# EAGLE design wctrl_led (EAGLE 7.6.0)
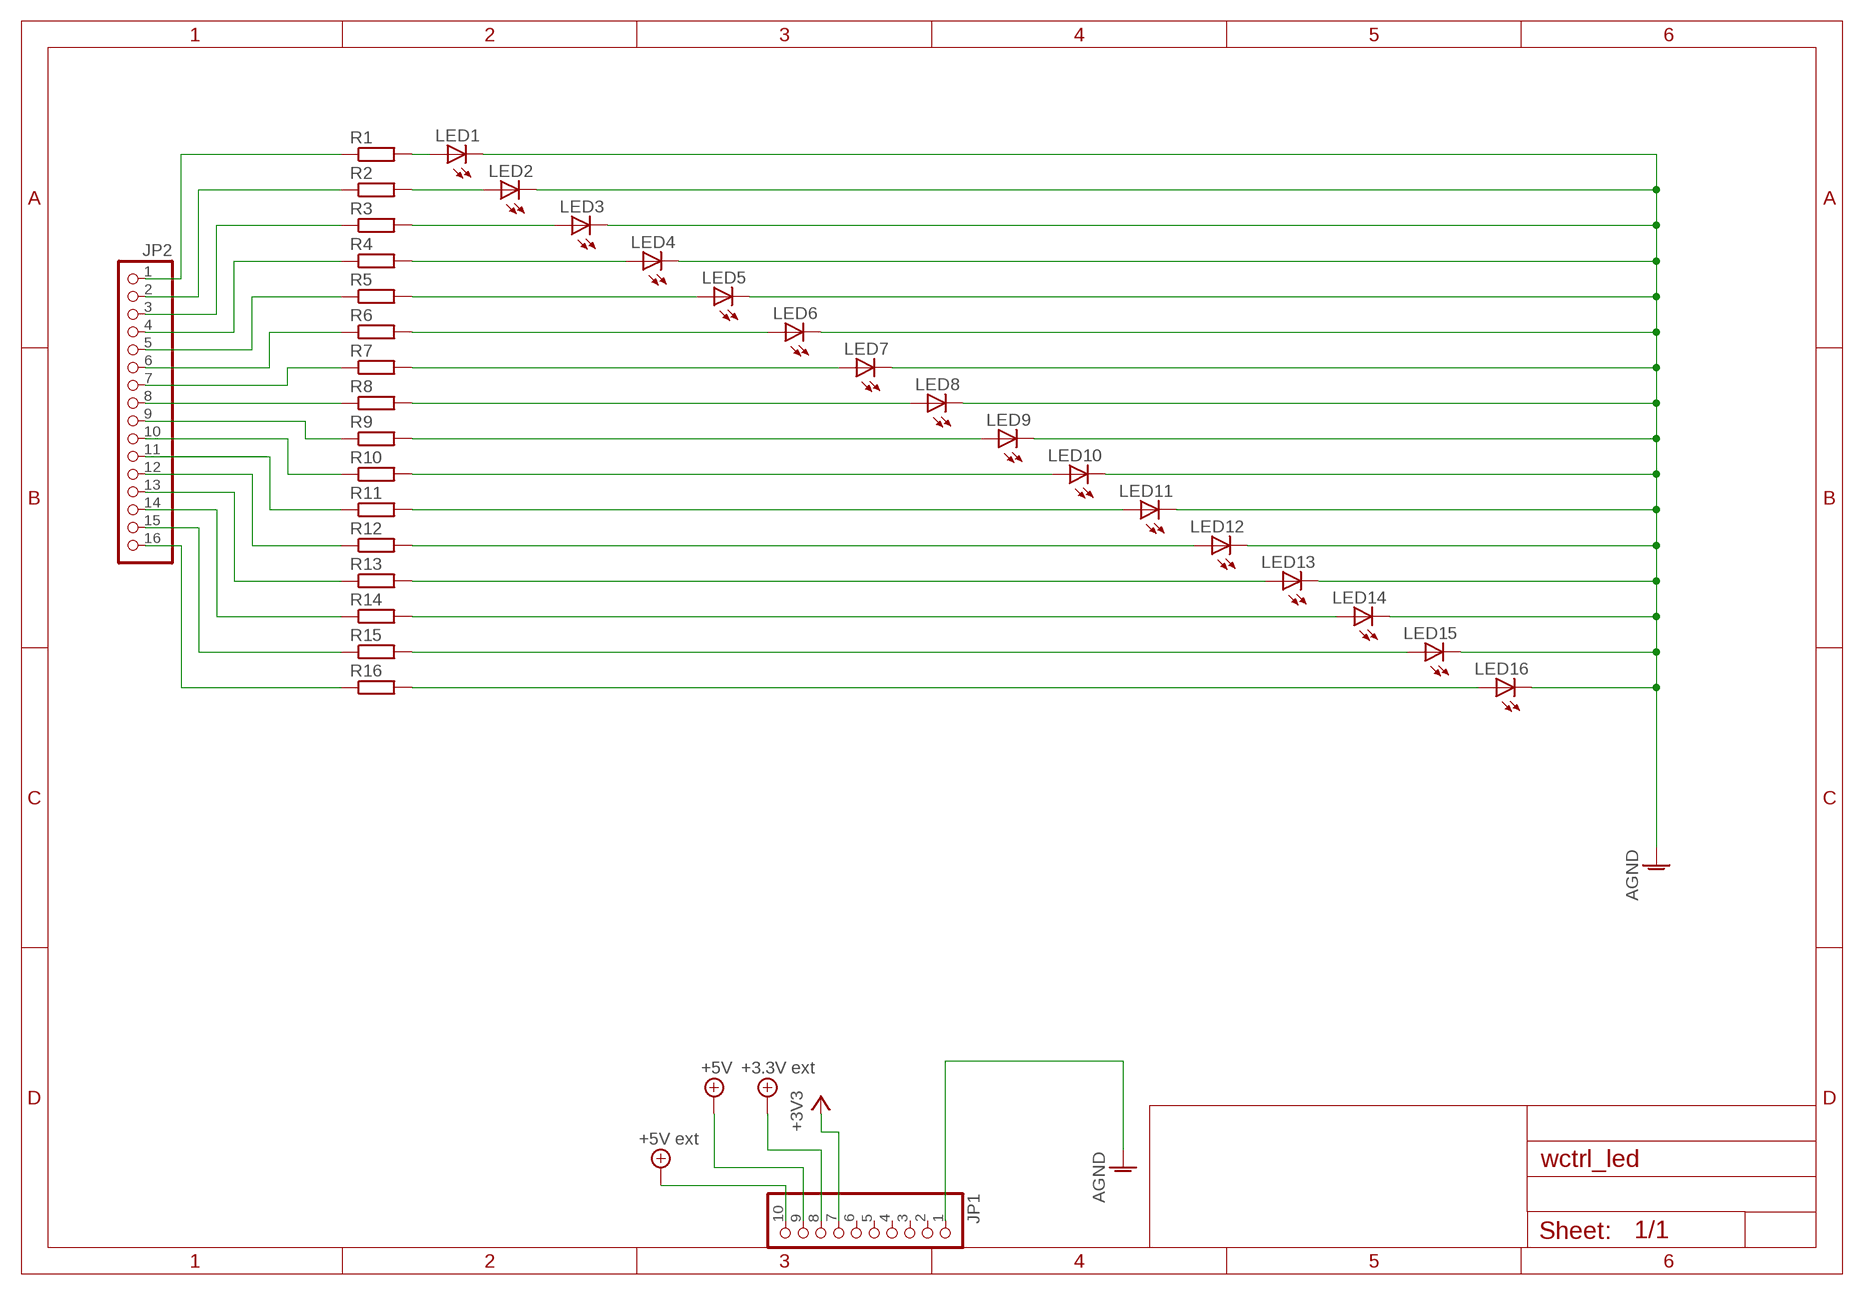
[diagram p0: schematic, sheet 1]

## Parts
JP1  PINHD-1X10  [1X10]
JP2  PINHD-1X16  [1X16]
LED1  LED5MM  [LED5MM]
LED2  LED5MM  [LED5MM]
LED3  LED5MM  [LED5MM]
LED4  LED5MM  [LED5MM]
LED5  LED5MM  [LED5MM]
LED6  LED5MM  [LED5MM]
LED7  LED5MM  [LED5MM]
LED8  LED5MM  [LED5MM]
LED9  LED5MM  [LED5MM]
LED10  LED5MM  [LED5MM]
LED11  LED5MM  [LED5MM]
LED12  LED5MM  [LED5MM]
LED13  LED5MM  [LED5MM]
LED14  LED5MM  [LED5MM]
LED15  LED5MM  [LED5MM]
LED16  LED5MM  [LED5MM]
R1  R-EU_0207/10  [0207/10]
R2  R-EU_0207/10  [0207/10]
R3  R-EU_0207/10  [0207/10]
R4  R-EU_0207/10  [0207/10]
R5  R-EU_0207/10  [0207/10]
R6  R-EU_0207/10  [0207/10]
R7  R-EU_0207/10  [0207/10]
R8  R-EU_0207/10  [0207/10]
R9  R-EU_0207/10  [0207/10]
R10  R-EU_0207/10  [0207/10]
R11  R-EU_0207/10  [0207/10]
R12  R-EU_0207/10  [0207/10]
R13  R-EU_0207/10  [0207/10]
R14  R-EU_0207/10  [0207/10]
R15  R-EU_0207/10  [0207/10]
R16  R-EU_0207/10  [0207/10]

## Nets
3.3VEXT: JP1.8 ; supply symbol labelled +3.3V ext
+3V3: JP1.7
+5V: JP1.9
+5V/1: JP1.10 ; supply symbol labelled +5V ext
AGND: JP1.1 LED1.K(C) LED2.K(C) LED3.K(C) LED4.K(C) LED5.K(C) LED6.K(C) LED7.K(C) LED8.K(C) LED9.K(C) LED10.K(C) LED11.K(C) LED12.K(C) LED13.K(C) LED14.K(C) LED15.K(C) LED16.K(C)
N$1: JP2.1 R1.1
N$2: LED1.A R1.2
N$3: JP2.2 R2.1
N$4: JP2.3 R3.1
N$5: JP2.4 R4.1
N$6: JP2.5 R5.1
N$7: JP2.6 R6.1
N$8: JP2.7 R7.1
N$9: JP2.8 R8.1
N$10: JP2.16 R16.1
N$11: JP2.15 R15.1
N$12: JP2.14 R14.1
N$13: JP2.13 R13.1
N$14: JP2.12 R12.1
N$15: JP2.11 R11.1
N$16: JP2.10 R10.1
N$17: JP2.9 R9.1
N$18: LED2.A R2.2
N$19: LED3.A R3.2
N$20: LED4.A R4.2
N$21: LED5.A R5.2
N$22: LED6.A R6.2
N$23: LED7.A R7.2
N$24: LED8.A R8.2
N$25: LED9.A R9.2
N$26: LED10.A R10.2
N$27: LED11.A R11.2
N$28: LED12.A R12.2
N$29: LED13.A R13.2
N$30: LED14.A R14.2
N$31: LED15.A R15.2
N$32: LED16.A R16.2
Unconnected: JP1.2 JP1.3 JP1.4 JP1.5 JP1.6

## Library data of the parts
JP1 = pinhead:PINHD-1X10: PIN HEADER
JP2 = pinhead:PINHD-1X16: PIN HEADER
LED1-LED16 = led:LED: LED OSRAM: - CHIPLED LG R971, LG N971, LY N971, LG Q971, LY Q971, LO R971, LY R971 LH N974, LH R974 LS Q976, LO Q976, LY Q976 LO Q996 - Hyper CHIPLED LW Q18S LB Q993, LB Q99A, LB R99A - SideLED LS A670, LO A670, LY A670, LG A670, LP A670 LB A673, LV A673, LT A673, LW A673 LH A674 LY A675 LS A676, LA A676, LO A676, LY A676, LW A676 LS A679, LY A679, LG A679 - Hyper Micro SIDELED® LS Y876, LA Y876, LO Y876, LY Y876 LT Y87S - SmartLED LW L88C, LW L88S LB L89C, LB L89S, LG L890 LS L89K, LO L89K, LY L89K LS L896, LA L896, LO L896, LY L896 - TOPLED LS T670, LO T670, LY T670, LG T670, LP T670 LSG T670, LSP T670, LSY T670, LOP T670, LYG T670 LG T671, LOG T671, LSG T671 LB T673, LV T673, LT T673, LW T673 LH T674 LS T676, LA T676, LO T676, LY T676, LB T676, LH T676, LSB T676, LW T676 LB T67C, LV T67C, LT T67C, LS T67K, LO T67K, LY T67K, LW E67C LS E67B, LA E67B, LO E67B, LY E67B, LB E67C, LV E67C, LT E67C LW T67C LS T679, LY T679, LG T679 LS T770, LO T770, LY T770, LG T770, LP T770 LB T773, LV T773, LT T773, LW T773 LH T774 LS E675, LA E675, LY E675, LS T675 LS T776, LA T776, LO T776, LY T776, LB T776 LHGB T686 LT T68C, LB T68C - Hyper Mini TOPLED® LB M676 - Mini TOPLED Santana® LG M470 LS M47K, LO M47K, LY M47K Source: http://www.osram.convergy.de LUXEON: - LUMILED® LXK2-PW12-R00, LXK2-PW12-S00, LXK2-PW14-U00, LXK2-PW14-V00 LXK2-PM12-R00, LXK2-PM12-S00, LXK2-PM14-U00 LXK2-PE12-Q00, LXK2-PE12-R00, LXK2-PE12-S00, LXK2-PE14-T00, LXK2-PE14-U00 LXK2-PB12-K00, LXK2-PB12-L00, LXK2-PB12-M00, LXK2-PB14-N00, LXK2-PB14-P00, LXK2-PB14-Q00 LXK2-PR12-L00, LXK2-PR12-M00, LXK2-PR14-Q00, LXK2-PR14-R00 LXK2-PD12-Q00, LXK2-PD12-R00, LXK2-PD12-S00 LXK2-PH12-R00, LXK2-PH12-S00 LXK2-PL12-P00, LXK2-PL12-Q00, LXK2-PL12-R00 Source: www.luxeon.com KINGBRIGHT: KA-3528ASYC Source: www.kingbright.com
R1-R16 = rcl:R-EU_: RESISTOR, European symbol

## Board
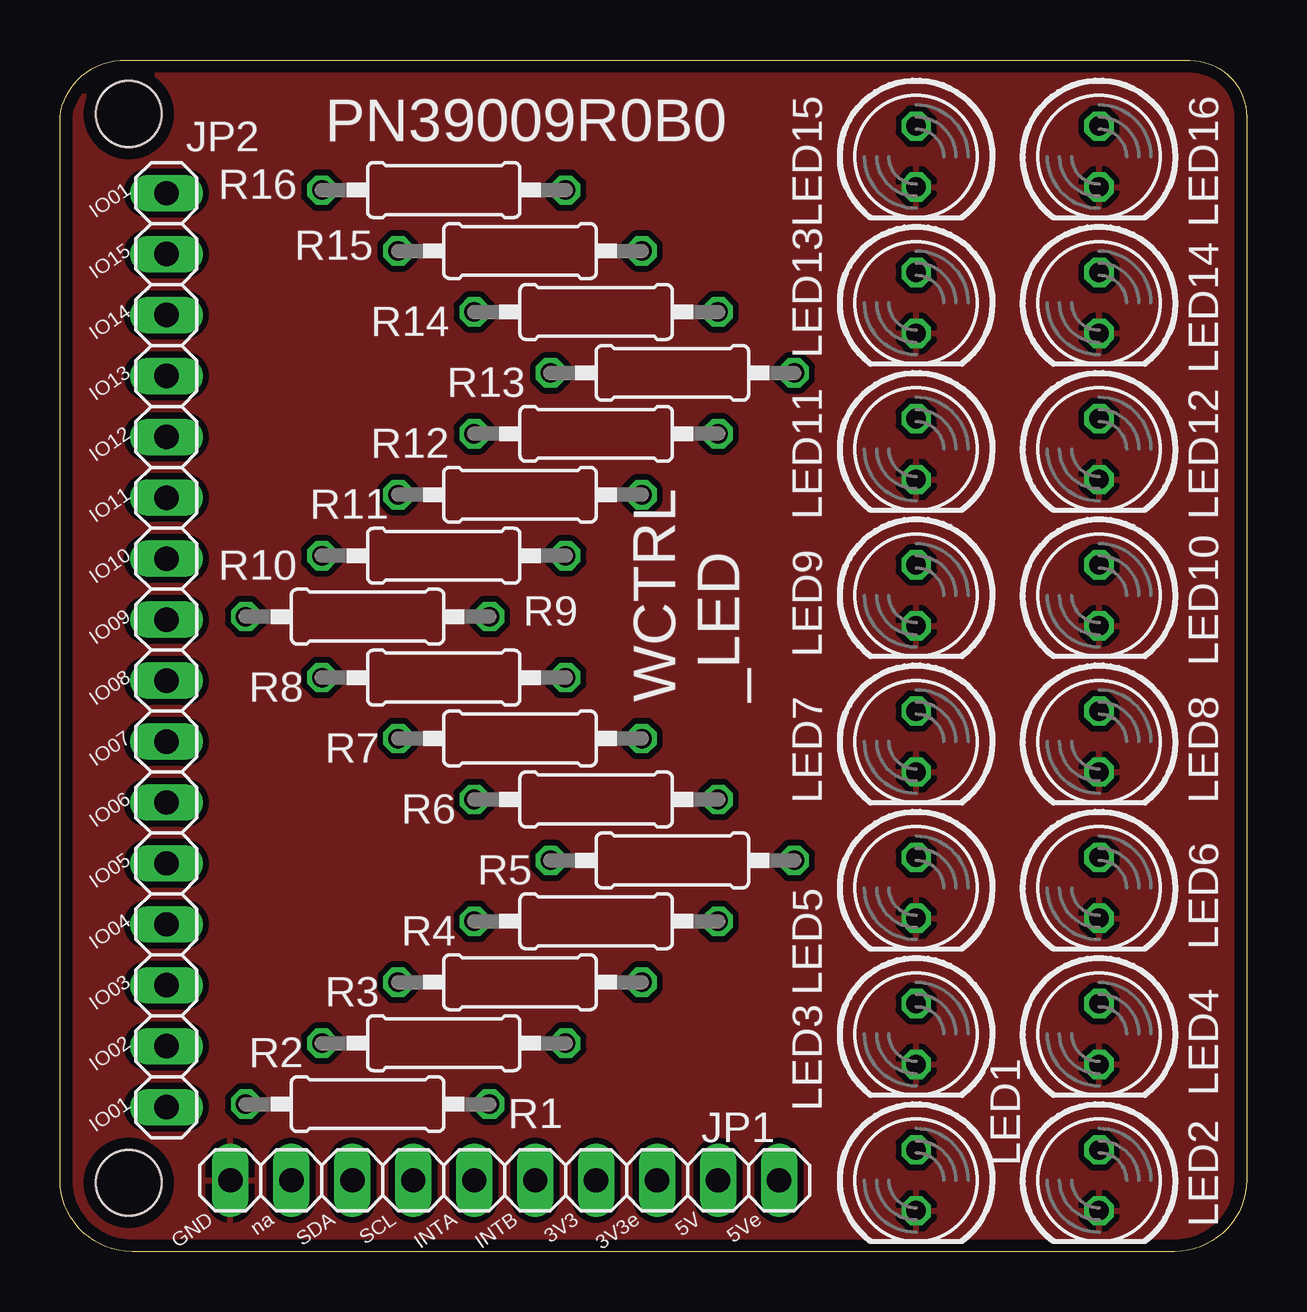
[diagram p1: board, top side]
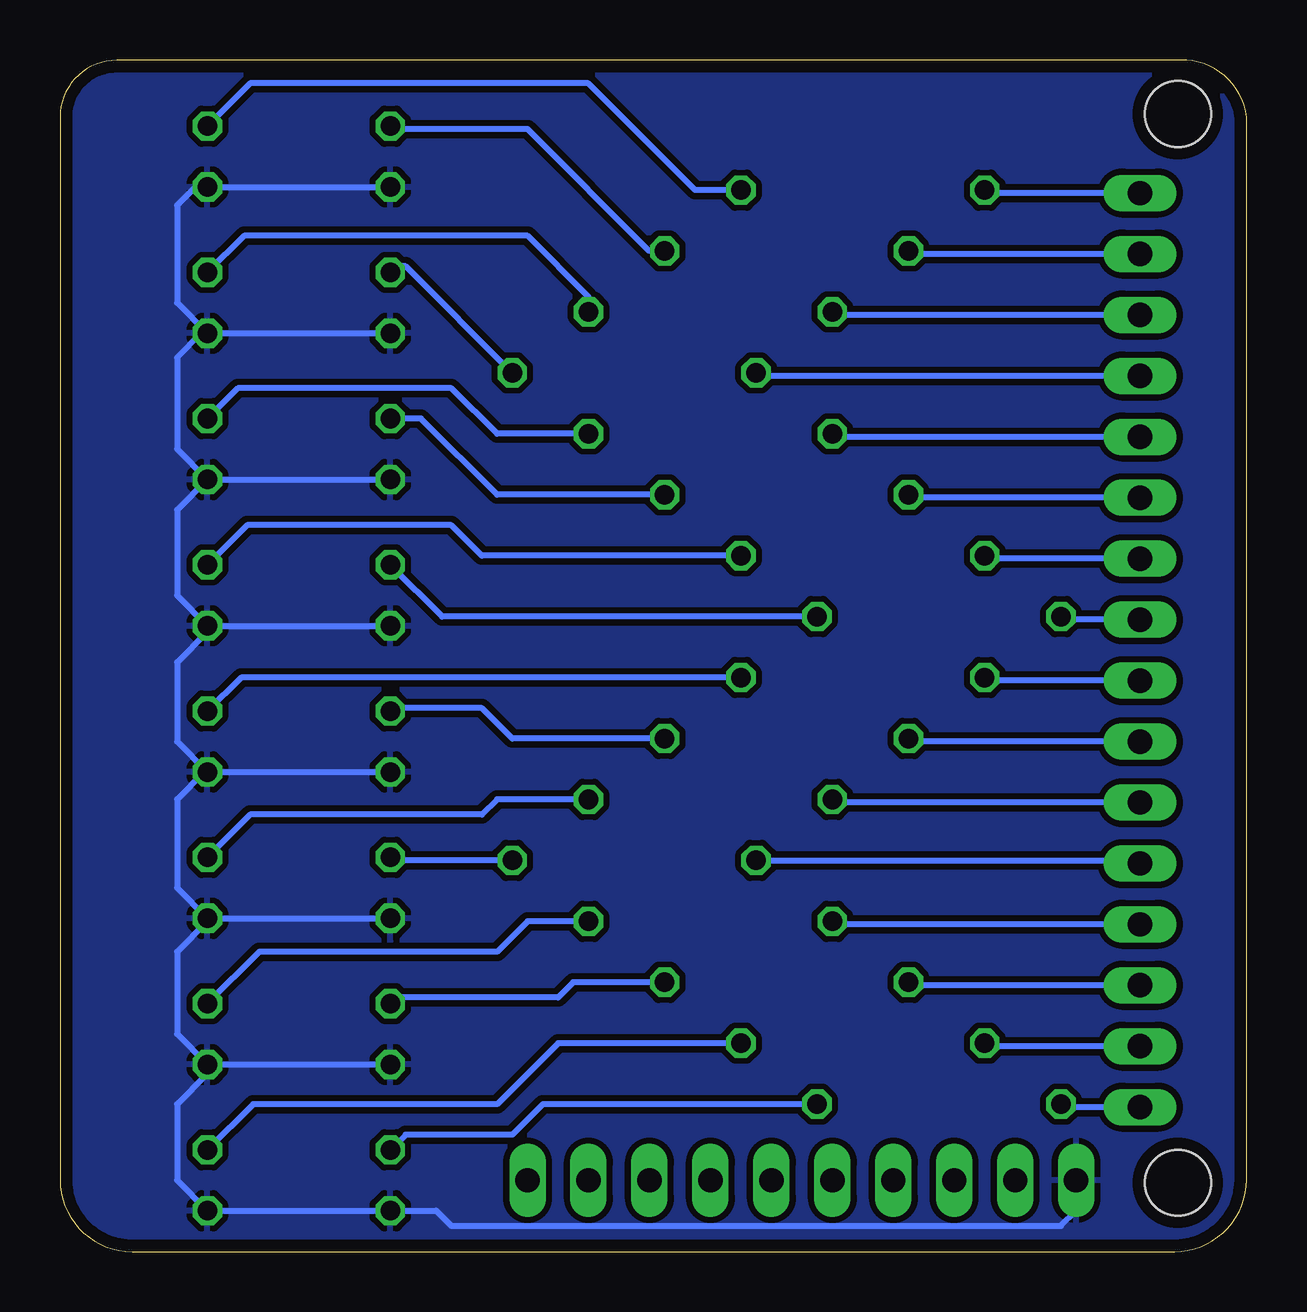
[diagram p2: board, bottom side, seen from below]

Size 49.44 x 49.67 mm. Coordinates in mm from the lower left corner, seen from the top.
Outline: 0,47.29 arc-90 3,49.65 47.07,49.65 arc-90 49.44,47.29 49.44,3 arc-90 46.44,0 3,0 arc-90 0,3 0,47.29
Copper layers (1*16): Top 0.035mm / dielectric 1.6mm / Bottom 0.035mm
Design rules "Elecrow_2-layer_PCB_eagle_rule": minimum track width 6mil, minimum drill 12mil, track to track 6mil, track to pad 6mil, pad to pad 6mil, via to via 8mil, smd to smd 0mil, copper to edge 20mil, drill to drill 10mil, minimum pad ring 6mil, minimum via ring 6mil, stop-mask expansion 0mil, vias tented up to drill 100mil, thermal gap 10mil
Holes 2.75 mm at 2.86,47.42 2.86,2.86

### Footprints (pad centres in the part's own frame; a part is rotated, then mirrored left to right if it is on the bottom)
1X10 = drill 1.016 long: 1 -11.43,0; 2 -8.89,0; 3 -6.35,0; 4 -3.81,0; 5 -1.27,0; 6 1.27,0; 7 3.81,0; 8 6.35,0; 9 8.89,0; 10 11.43,0
1X16 = drill 1.016 long: 1 -19.05,0; 2 -16.51,0; 3 -13.97,0; 4 -11.43,0; 5 -8.89,0; 6 -6.35,0; 7 -3.81,0; 8 -1.27,0; 9 1.27,0; 10 3.81,0; 11 6.35,0; 12 8.89,0; 13 11.43,0; 14 13.97,0; 15 16.51,0; 16 19.05,0
LED5MM = drill 0.813 octagon: A -1.27,0; K 1.27,0
0207/10 = drill 0.813 octagon: 1 -5.08,0; 2 5.08,0

### Placement (x,y rotation side)
JP1  18.53,2.97 0 top
JP2  4.43,25.07 90 top
LED1  35.67,2.97 270 top
LED2  43.29,2.97 270 top
LED3  35.67,9.07 270 top
LED4  43.29,9.07 270 top
LED5  35.67,15.16 270 top
LED6  43.29,15.16 270 top
LED7  35.67,21.26 270 top
LED8  43.29,21.26 270 top
LED9  35.67,27.35 270 top
LED10  43.29,27.35 270 top
LED11  35.67,33.45 270 top
LED12  43.29,33.45 270 top
LED13  35.67,39.55 270 top
LED14  43.29,39.55 270 top
LED15  35.67,45.64 270 top
LED16  43.29,45.64 270 top
R1  12.81,6.15 0 top
R2  15.99,8.68 0 top
R3  19.17,11.22 0 top
R4  22.34,13.76 0 top
R5  25.52,16.3 0 top
R6  22.34,18.84 0 top
R7  19.17,21.38 0 top
R8  15.99,23.92 0 top
R9  12.81,26.46 0 top
R10  15.99,29 0 top
R11  19.17,31.54 0 top
R12  22.34,34.09 0 top
R13  25.52,36.62 0 top
R14  22.34,39.16 0 top
R15  19.17,41.71 0 top
R16  15.99,44.25 0 top

### Tracks (layer width: path | path; a pad name or v marks a point on that pad's centre or on a via)
AGND
  Bottom 0.254: LED15.K LED16.K 43.8,44.37 44.56,43.61 44.56,39.55 LED14.K | LED14.K LED13.K | LED12.K LED11.K | LED10.K LED9.K | LED8.K LED7.K | LED6.K LED5.K | LED4.K LED3.K | LED14.K 43.55,38.28 44.56,37.26 44.56,33.45 LED12.K | LED12.K 44.56,30.91 44.56,27.35 LED10.K | LED10.K 43.29,25.83 44.56,24.56 44.56,21.26 LED8.K | LED8.K 43.42,19.99 44.56,18.84 44.56,15.16 LED6.K | LED6.K 43.29,13.76 44.56,12.49 44.56,9.07 LED4.K | LED4.K 43.29,7.42 44.56,6.15 44.56,2.97 LED2.K LED1.K 33.77,1.7 33.13,1.07 7.73,1.07 7.1,1.7 JP1.1
  pour Bottom (isolate 0.254): 0.11,47.42 arc-90 2.02,49.33 3.93,49.33 47.74,49.33 arc-90 49.64,47.42 49.64,46.15 49.64,2.97 arc-90 46.47,-0.21 45.84,-0.21 2.65,-0.21 arc-90 0.11,2.33 0.11,2.97
  pour Top (isolate 0.254): 0.11,47.42 arc-90 2.02,49.33 2.65,49.33 47.1,49.33 arc-90 49.64,46.79 49.64,2.97 arc-90 46.47,-0.21 45.84,-0.21 2.65,-0.21 arc-90 0.11,2.33
N$1
  Bottom 0.254: JP2.1 7.61,6.02 R1.1
N$2
  Bottom 0.254: R1.2 29.32,6.15 30.6,4.87 35.04,4.87 LED1.A
N$3
  Bottom 0.254: JP2.2 10.78,8.56 R2.1
N$4
  Bottom 0.254: JP2.3 13.96,11.1 R3.1
N$5
  Bottom 0.254: JP2.4 17.13,13.64 R4.1
N$6
  Bottom 0.254: R5.1 4.56,16.3 JP2.5
N$7
  Bottom 0.254: JP2.6 17.13,18.72 R6.1
N$8
  Bottom 0.254: JP2.7 13.96,21.26 R7.1
N$9
  Bottom 0.254: JP2.8 10.78,23.8 R8.1
N$10
  Bottom 0.254: JP2.16 10.78,44.12 R16.1
N$11
  Bottom 0.254: JP2.15 13.96,41.58 R15.1
N$12
  Bottom 0.254: JP2.14 17.13,39.04 R14.1
N$13
  Bottom 0.254: JP2.13 20.31,36.5 R13.1
N$14
  Bottom 0.254: JP2.12 17.13,33.96 R12.1
N$15
  Bottom 0.254: JP2.11 13.96,31.42 R11.1
N$16
  Bottom 0.254: JP2.10 10.78,28.88 R10.1
N$17
  Bottom 0.254: JP2.9 7.61,26.34 R9.1
N$18
  Bottom 0.254: R2.2 28.69,8.68 31.23,6.15 41.39,6.15 LED2.A
N$19
  Bottom 0.254: R3.2 28.05,11.22 28.69,10.59 35.42,10.59 LED3.A
N$20
  Bottom 0.254: R4.2 29.96,13.76 31.23,12.49 41.14,12.49 LED4.A
N$21
  Bottom 0.254: R5.2 35.55,16.3 LED5.A
N$22
  Bottom 0.254: R6.2 31.23,18.84 31.86,18.21 41.52,18.21 LED6.A
N$23
  Bottom 0.254: R7.2 30.6,21.38 31.86,22.65 35.55,22.65 LED7.A
N$24
  Bottom 0.254: R8.2 41.9,23.92 LED8.A
N$25
  Bottom 0.254: R9.2 33.52,26.46 LED9.A
N$26
  Bottom 0.254: R10.2 31.86,29 33.13,30.28 41.64,30.28 LED10.A
N$27
  Bottom 0.254: R11.2 31.23,31.54 34.41,34.72 LED11.A
N$28
  Bottom 0.254: R12.2 31.23,34.09 33.13,35.99 42.02,35.99 LED12.A
N$29
  Bottom 0.254: R13.2 35.04,41.07 35.42,41.07 LED13.A
N$30
  Bottom 0.254: R14.2 27.42,39.8 29.96,42.34 41.77,42.34 LED14.A
N$31
  Bottom 0.254: R15.2 24.88,41.71 29.96,46.79 35.55,46.79 LED15.A
N$32
  Bottom 0.254: R16.2 22.98,44.25 27.42,48.69 41.52,48.69 LED16.A

### Text on the board
tNames: PN39009R0B0 | IO01 | IO15 | IO14 | IO13 | IO12 | IO11 | IO10 | IO09 | IO08 | WCTRL / _LED | IO07 | IO06 | IO05 | IO04 | IO03 | IO02 | IO01 | GND | na | SDA | SCL | INTA | INTB | 3V3 | 3V3e | 5V | 5Ve
tTest: GND | SDA | SCL | INTB | INTA | 3.3V | 3.3Ve | 5V | 5Ve